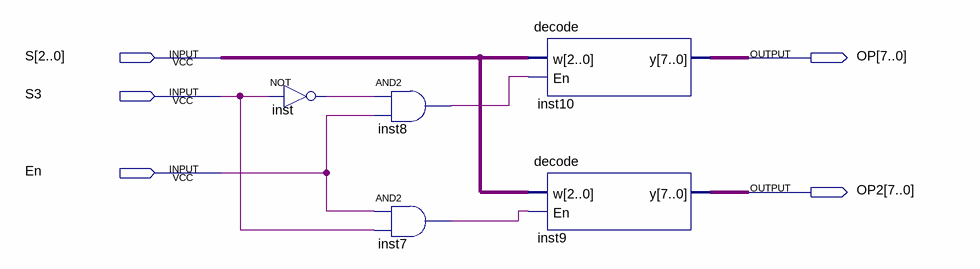
[diagram p0: schematic sheet]
// Quartus schematic 3to8decodto4to16decod.bdf as structural Verilog: 5 symbols, 5 pins
module \3to8decodto4to16decod  (
  input  [2:0] S,
  input  S3,
  input  En,
  output [7:0] OP,
  output [7:0] OP2
);

  wire inst7_out, inst8_out, inst_out;

  not inst (inst_out, S3);
  and inst8 (inst8_out, inst_out, En);
  and inst7 (inst7_out, En, S3);
  decode inst10 (.w(S), .En(inst8_out), .y(OP));
  decode inst9 (.w(S), .En(inst7_out), .y(OP2));
endmodule
